# EasyEDA schematic Dot-Matrix.json
TITLE: Dot-Matrix; REV: 1.0; Date: 2022-06-19; Sheet: 1/1; Drawn By: MYAN; Company: Your Company
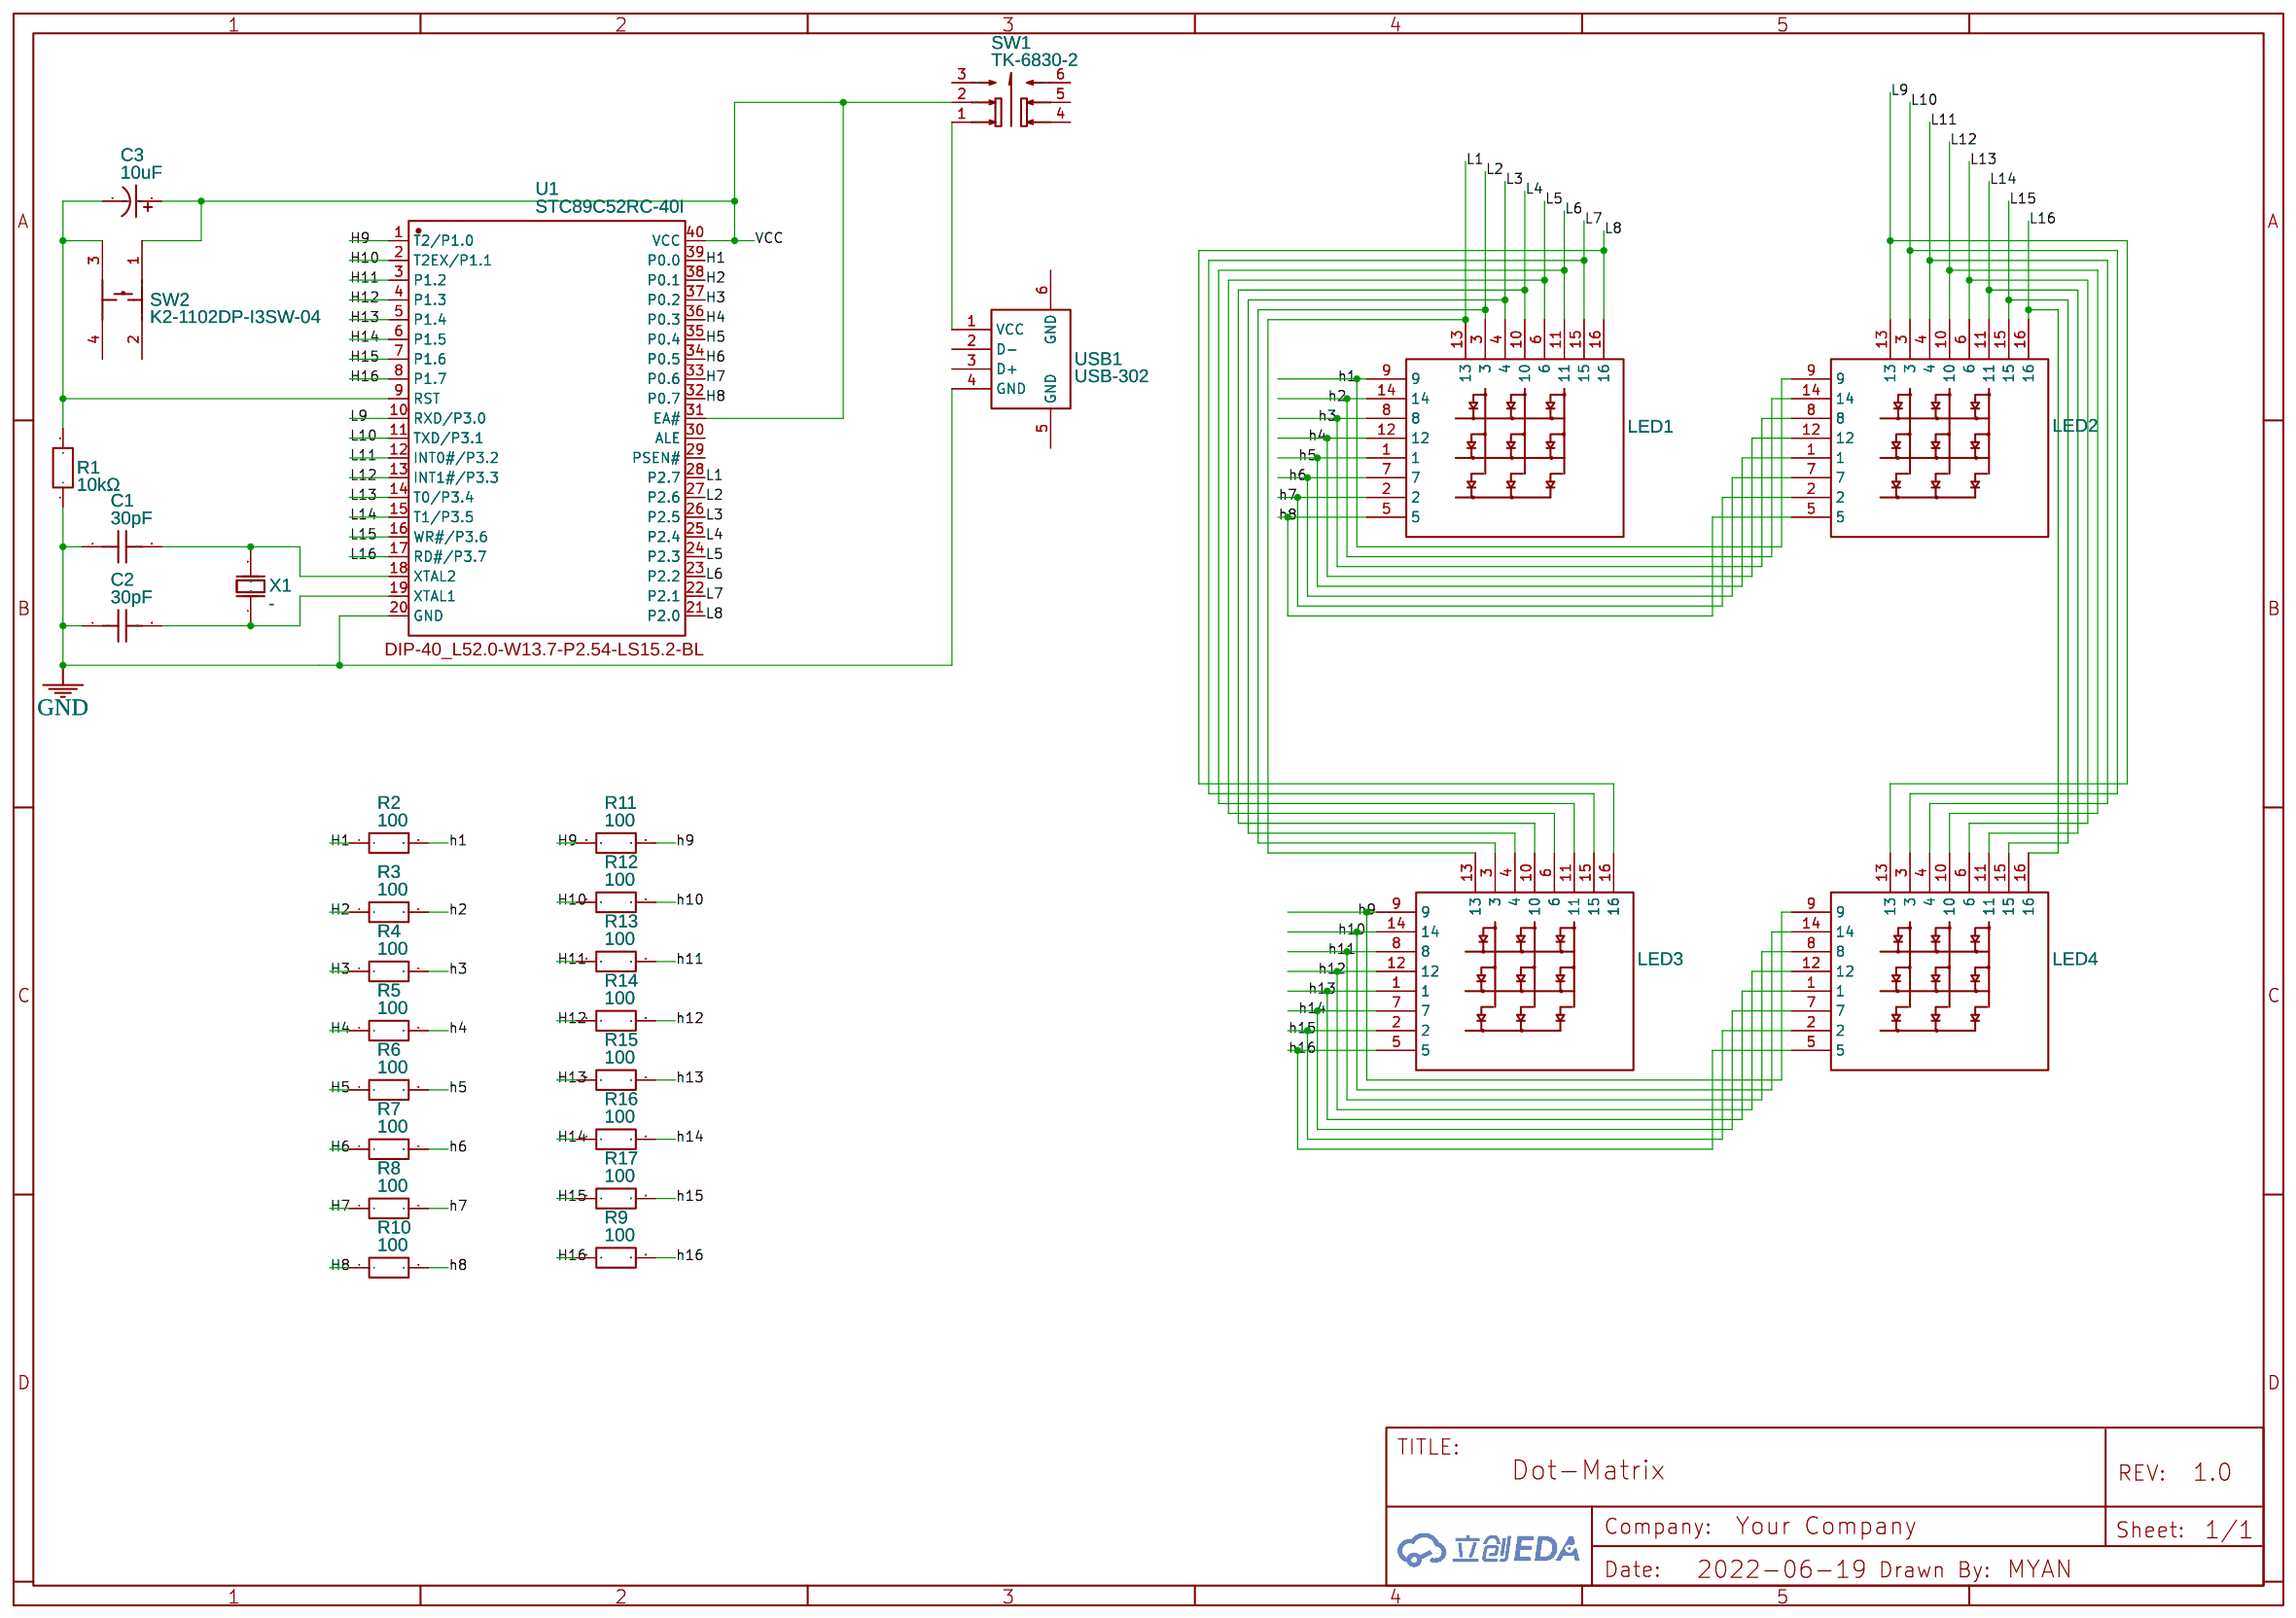
[diagram p0: schematic sheet]

## Parts
C1  30pF  [CAP-TH_L6.0-W3.5-P7.50-D1.0]
C2  30pF  [CAP-TH_L6.0-W3.5-P7.50-D1.0]
C3  10uF  [CAP-TH_BD6.3-P2.50-D1.0-FD]
LED1  SLD0888DWC1BY_C2913073  [LED-SEG-TH_16P-L20.0-W20.0-P2.50-S15.0-BL-1]
LED2  SLD0888DWC1BY_C2913073  [LED-SEG-TH_16P-L20.0-W20.0-P2.50-S15.0-BL-1]
LED3  SLD0888DWC1BY_C2913073  [LED-SEG-TH_16P-L20.0-W20.0-P2.50-S15.0-BL-1]
LED4  SLD0888DWC1BY_C2913073  [LED-SEG-TH_16P-L20.0-W20.0-P2.50-S15.0-BL-1]
R1  10kΩ  [RES-TH_BD5.0-L15.5-P19.50-D0.7]
R2  100  [R_AXIAL-0.3]
R3  100  [R_AXIAL-0.3]
R4  100  [R_AXIAL-0.3]
R5  100  [R_AXIAL-0.3]
R6  100  [R_AXIAL-0.3]
R7  100  [R_AXIAL-0.3]
R8  100  [R_AXIAL-0.3]
R9  100  [R_AXIAL-0.3]
R10  100  [R_AXIAL-0.3]
R11  100  [R_AXIAL-0.3]
R12  100  [R_AXIAL-0.3]
R13  100  [R_AXIAL-0.3]
R14  100  [R_AXIAL-0.3]
R15  100  [R_AXIAL-0.3]
R16  100  [R_AXIAL-0.3]
R17  100  [R_AXIAL-0.3]
SW1  TK-6830-2  [SW-TH_TK-6830-2]
SW2  K2-1102DP-I3SW-04  [KEY-TH_4P-L6.4-W6.0-P4.50-LS7.3-TL]
U1  STC89C52RC-40I  [DIP-40_L52.0-W13.7-P2.54-LS15.2-BL]
USB1  USB-302  [USB-A-TH_USB-302-T]
X1  -  [HC-49US_L11.5-W4.5-P4.88]

## Library data of the parts
C1 C2 = S07S1E330KN0B0S0N0: Supplier: LCSC; Supplier Part: C260735; Manufacturer: Songtian Elec; Contributor: LCSC; JLCPCB Part Class: Extended Part
C3 = 10uf/100V: Supplier: LCSC; Manufacturer: ValuePro; Supplier Part: C2029; JLCPCB Part Class: Extended Part
LED1-LED4 = SLD0888DWC1BY_C2913073: Supplier: LCSC; Supplier Part: C2913073; Manufacturer: SUNLIGHT(光华); Manufacturer Part: SLD0888DWC1BY; Contributor: LCSC
R1 = MF3WS-10KΩ±1%T: Supplier: LCSC; Supplier Part: C714189; Manufacturer: Huaxing Mechanical-Elec.; Contributor: LCSC; JLCPCB Part Class: Extended Part
R2-R17 = R_AXIAL-0.3_EU: Contributor: LCEDA_Lib
SW1 = TK-6830-2: Supplier: LCSC; Supplier Part: C528789; Manufacturer: Yuandi(台湾元迪); Contributor: LCSC; JLCPCB Part Class: Extended Part
SW2 = K2-1102DP-I3SW-04: Supplier: LCSC; Supplier Part: C2685962; Manufacturer: 韩国韩荣; Contributor: LCSC; JLCPCB Part Class: Extended Part
U1 = STC89C52RC-40I: Supplier: LCSC; Manufacturer: STC; Supplier Part: C14022; JLCPCB Part Class: Extended Part; Package Display: Yes
USB1 = USB-302: Supplier: LCSC; Manufacturer: SOFNG; Supplier Part: C112456; JLCPCB Part Class: Extended Part
X1 = ESA11.0592F20M25F: Supplier: LCSC; Supplier Part: C353687; Manufacturer: ZHUHAI MONEC ELEC; Contributor: LCSC; JLCPCB Part Class: Extended Part

## Nets
GND: C1.1 C2.1 R1.1 U1.20(GND) USB1.4(GND)
VCC: C3.1 SW1.2 SW2.1 U1.31(EA#) U1.40(VCC)
H1: R2.1 U1.39(P0.0)
h1: LED1.9 LED2.9 R2.2
H2: R3.1 U1.38(P0.1)
h2: LED1.14 LED2.14 R3.2
H3: R4.1 U1.37(P0.2)
h3: LED1.8 LED2.8 R4.2
H4: R5.1 U1.36(P0.3)
h4: LED1.12 LED2.12 R5.2
H5: R6.1 U1.35(P0.4)
h5: LED1.1 LED2.1 R6.2
H6: R7.1 U1.34(P0.5)
h6: LED1.7 LED2.7 R7.2
H7: R8.1 U1.33(P0.6)
h7: LED1.2 LED2.2 R8.2
H8: R10.1 U1.32(P0.7)
h8: LED1.5 LED2.5 R10.2
H9: R11.1 U1.1(T2/P1.0)
h9: LED3.9 LED4.9 R11.2
H10: R12.1 U1.2(T2EX/P1.1)
h10: LED3.14 LED4.14 R12.2
H11: R13.1 U1.3(P1.2)
h11: LED3.8 LED4.8 R13.2
H12: R14.1 U1.4(P1.3)
h12: LED3.12 LED4.12 R14.2
H13: R15.1 U1.5(P1.4)
h13: LED3.1 LED4.1 R15.2
H14: R16.1 U1.6(P1.5)
h14: LED3.7 LED4.7 R16.2
H15: R17.1 U1.7(P1.6)
h15: LED3.2 LED4.2 R17.2
H16: R9.1 U1.8(P1.7)
h16: LED3.5 LED4.5 R9.2
L1: LED1.13 LED3.13 U1.28(P2.7)
L2: LED1.3 LED3.3 U1.27(P2.6)
L3: LED1.4 LED3.4 U1.26(P2.5)
L4: LED1.10 LED3.10 U1.25(P2.4)
L5: LED1.6 LED3.6 U1.24(P2.3)
L6: LED1.11 LED3.11 U1.23(P2.2)
L7: LED1.15 LED3.15 U1.22(P2.1)
L8: LED1.16 LED3.16 U1.21(P2.0)
L9: LED2.13 LED4.13 U1.10(RXD/P3.0)
L10: LED2.3 LED4.3 U1.11(TXD/P3.1)
L11: LED2.4 LED4.4 U1.12(INT0#/P3.2)
L12: LED2.10 LED4.10 U1.13(INT1#/P3.3)
L13: LED2.6 LED4.6 U1.14(T0/P3.4)
L14: LED2.11 LED4.11 U1.15(T1/P3.5)
L15: LED2.15 LED4.15 U1.16(WR#/P3.6)
L16: LED2.16 LED4.16 U1.17(RD#/P3.7)
Net-(C1-2): C1.2 U1.18(XTAL2) X1.2(OSC2)
Net-(C2-2): C2.2 U1.19(XTAL1) X1.1(OSC1)
Net-(C3-2): C3.2 R1.2 SW2.3 U1.9(RST)
Net-(SW1-1): SW1.1 USB1.1(VCC)

Not connected (* = marked no-connect by the designer): SW1 3 4 5 6; SW2 2 4; U1 29(PSEN#) 30(ALE); USB1 2(D-) 3(D+) 5(GND) 6(GND)
